# Altium schematic sheet Attenuator.SchDoc
size Letter; SheetNumber: 2
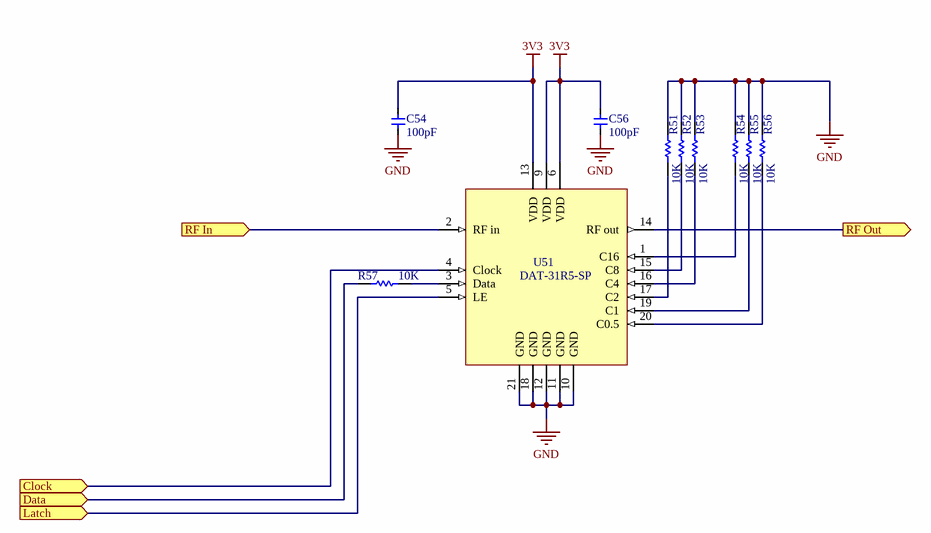
[diagram p0: Attenuator.SchDoc]

## Parts
C54  value 100pF  [0603C]  (hidden comment: SMT Cap)
C56  value 100pF  [0603C]  (hidden comment: SMT Cap)
R51  value 10K  [0603R]  (hidden comment: RES Semi)
R52  value 10K  [0603R]  (hidden comment: RES Semi)
R53  value 10K  [0603R]  (hidden comment: RES Semi)
R54  value 10K  [0603R]  (hidden comment: RES Semi)
R55  value 10K  [0603R]  (hidden comment: RES Semi)
R56  value 10K  [0603R]  (hidden comment: RES Semi)
R57  value 10K  [0603R]  (hidden comment: RES Semi)
U51  DAT-31R5-SP  [QFN50P400X400X90_HS-21N]

## Ports
Clock (in), Data (in), Latch (in), RF In (in), RF Out (out)

## Nets
3V3: C54.2 C56.2 U51.6(VDD) U51.9(VDD) U51.13(VDD)
GND: C54.1 C56.1 R51.2 R52.2 R53.2 R54.2 R55.2 R56.2 U51.10(GND) U51.11(GND) U51.12(GND) U51.18(GND) U51.21(GND)
Clock: U51.4(Clock) ; port Clock
Data: R57.2 ; port Data
Latch: U51.5(LE) ; port Latch
RF In: U51.2(RF_in) ; port RF In
RF Out: U51.14(RF_out) ; port RF Out
NetR51_1: R51.1 U51.17(C2)
NetR52_1: R52.1 U51.15(C8)
NetR53_1: R53.1 U51.16(C4)
NetR54_1: R54.1 U51.1(C16)
NetR55_1: R55.1 U51.19(C1)
NetR56_1: R56.1 U51.20(C0.5)
NetR57_1: R57.1 U51.3(Data)

Not connected (* = marked no-connect by the designer): U51 7(N/C) 8(N/C)

## Library data of the parts
C54 C56 = Cap - SMT Small: Published: 8-Jun-2000; LatestRevisionDate: 29-May-2009; LatestRevisionNote: IPC-7351 Footprint Added.; PackageReference: C1206; Publisher: Altium Limited; PackageDescription: Chip Capacitor
R51-R57 = RES Semi: Semiconductor Resistor; Published: 8-Jun-2000; LatestRevisionDate: 17-Jul-2002; LatestRevisionNote: Re-released for DXP Platform.; PackageReference: AXIAL-0.5; Publisher: Altium Limited
U51 = DAT-31R5-SP: 31.5 dB, 0.5 dB Step 6 Bit, Serial Control Interface, Single Positive Supply Voltage